# Altium schematic sheet ArbPwrBoost_P4.SchDoc: =ProjectTitle
size B; Engineer: Hab Collector; Organization: Altium Limited; Address1: 3621 Gin Way; Address2: Snellville, GA 30039; SheetNumber: 4; SheetTotal: 8
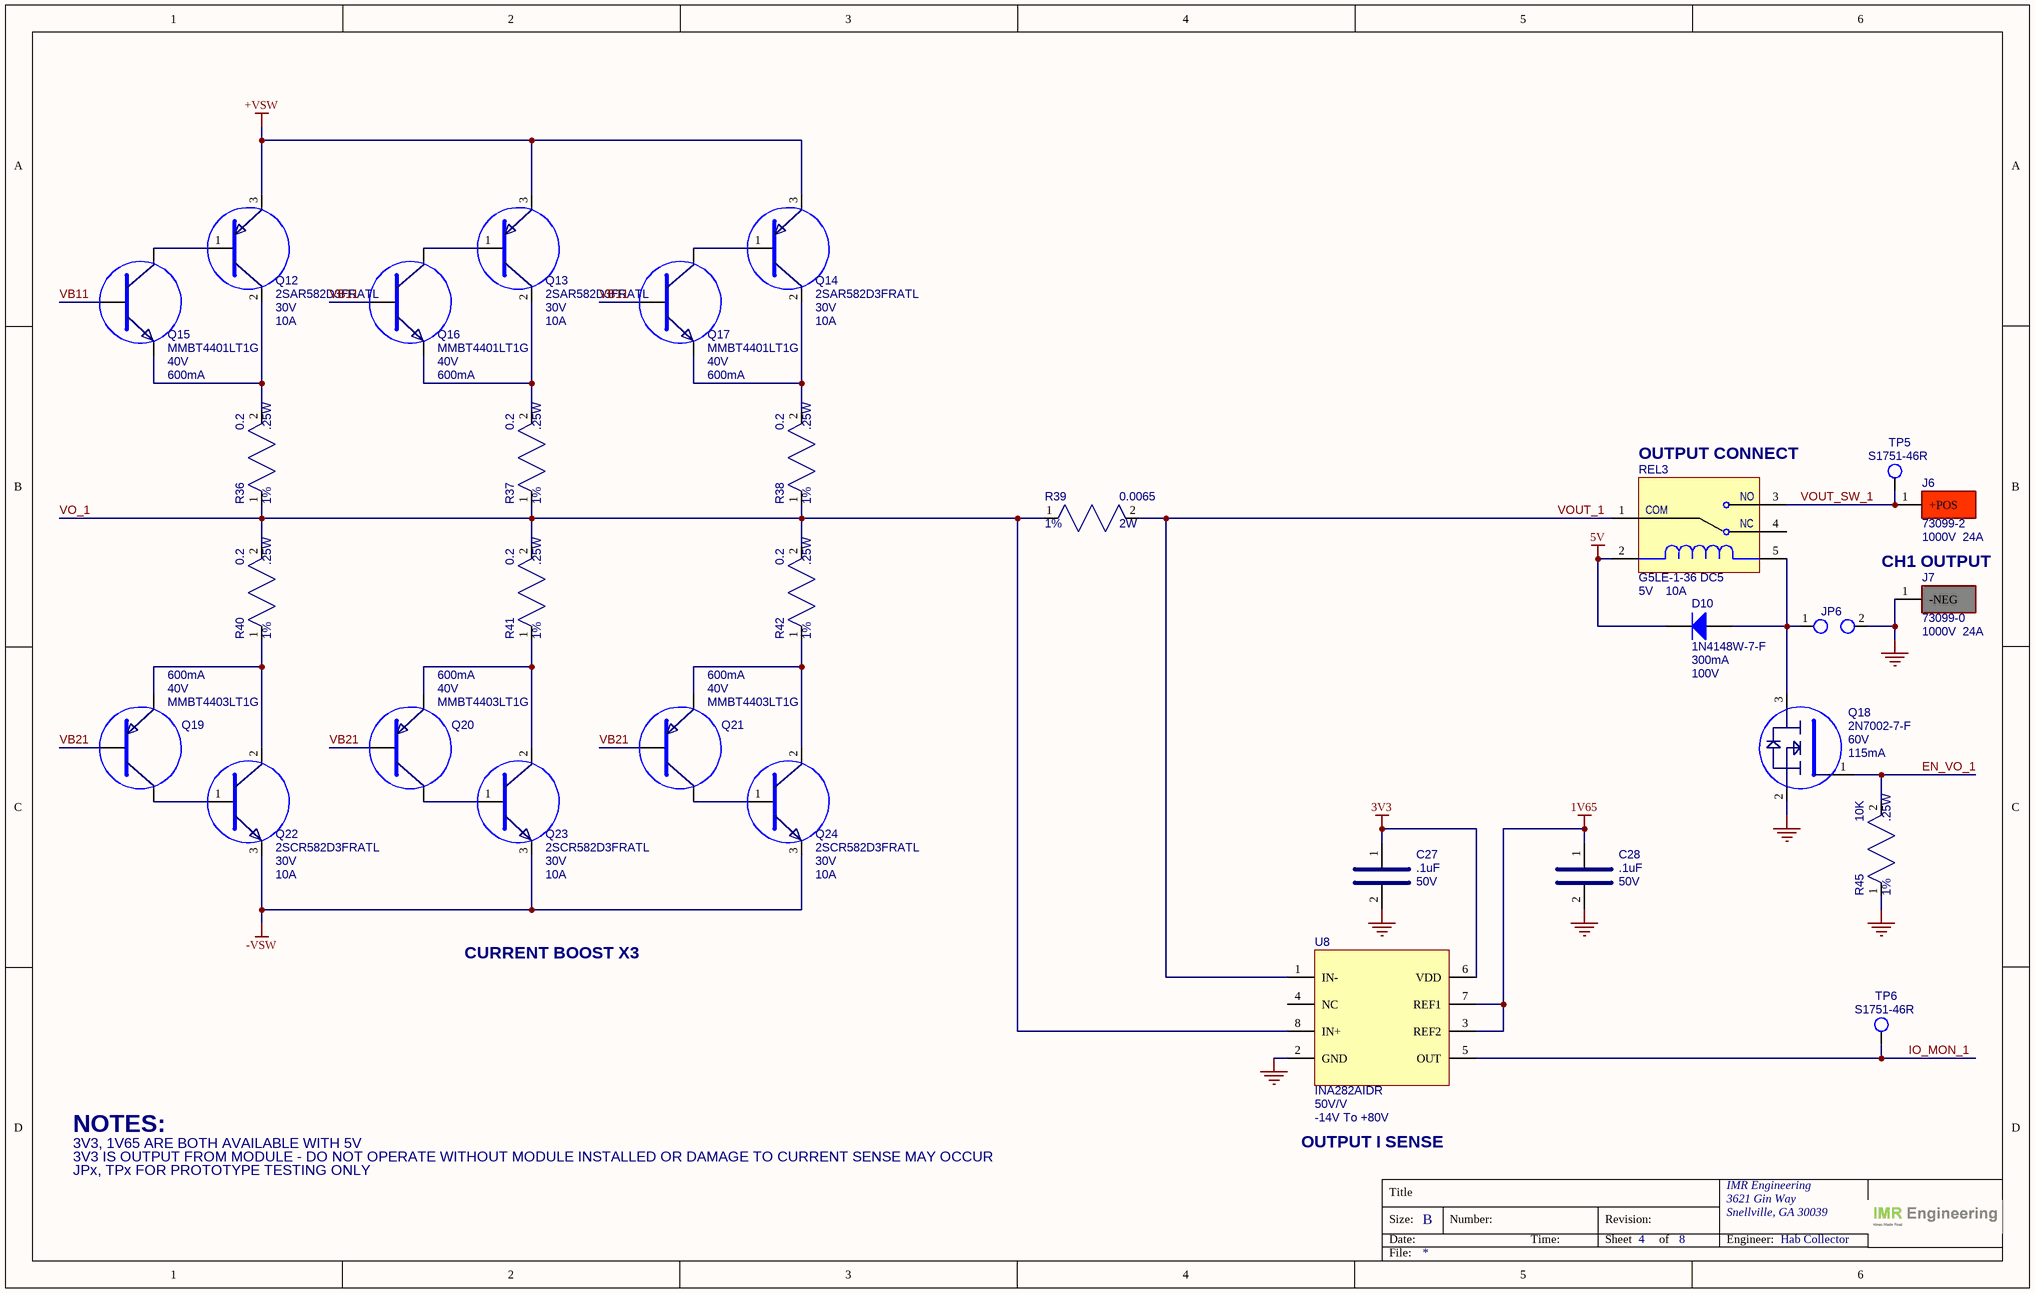
[diagram p0: ArbPwrBoost_P4.SchDoc]

## Parts
C27  value .1uF  Voltage: 50V  [CAP_0805]  (hidden comment: KGM21NR71H104KT)
C28  value .1uF  Voltage: 50V  [CAP_0805]  (hidden comment: KGM21NR71H104KT)
D10  value 100V  Current: 300mA  [SOD123]  (hidden comment: 1N4148W-7-F)
J6  value 1000V  Current: 24A  [Pomona_73099-2]  (hidden comment: 73099-2)
J7  value 1000V  Current: 24A  [Pomona_73099-0]  (hidden comment: 73099-0)
JP6  PREC002SFAN-RC  [HDR_1X2_100MILL]  (value not drawn)
Q12  value 30V  Current: 10A  [TO-252]  (hidden comment: 2SAR582D3FRATL)
Q13  value 30V  Current: 10A  [TO-252]  (hidden comment: 2SAR582D3FRATL)
Q14  value 30V  Current: 10A  [TO-252]  (hidden comment: 2SAR582D3FRATL)
Q15  value 40V  Current: 600mA  [SOT-23]  (hidden comment: MMBT4401LT1G)
Q16  value 40V  Current: 600mA  [SOT-23]  (hidden comment: MMBT4401LT1G)
Q17  value 40V  Current: 600mA  [SOT-23]  (hidden comment: MMBT4401LT1G)
Q18  value 60V  Current: 115mA  [SOT-23]  (hidden comment: 2N7002-7-F)
Q19  value 40V  Current: 600mA  [SOT-23]  (hidden comment: MMBT4403LT1G)
Q20  value 40V  Current: 600mA  [SOT-23]  (hidden comment: MMBT4403LT1G)
Q21  value 40V  Current: 600mA  [SOT-23]  (hidden comment: MMBT4403LT1G)
Q22  value 30V  Current: 10A  [TO-252]  (hidden comment: 2SCR582D3FRATL)
Q23  value 30V  Current: 10A  [TO-252]  (hidden comment: 2SCR582D3FRATL)
Q24  value 30V  Current: 10A  [TO-252]  (hidden comment: 2SCR582D3FRATL)
R36  value 0.2  Power: .25W  Tolerance: 1%  [RES_1206]  (hidden comment: RL1206FR-070R2L)
R37  value 0.2  Power: .25W  Tolerance: 1%  [RES_1206]  (hidden comment: RL1206FR-070R2L)
R38  value 0.2  Power: .25W  Tolerance: 1%  [RES_1206]  (hidden comment: RL1206FR-070R2L)
R39  value 0.0065  Tolerance: 1%  Power: 2W  [RES_2512]  (hidden comment: WSL25126L500FEA18)
R40  value 0.2  Power: .25W  Tolerance: 1%  [RES_1206]  (hidden comment: RL1206FR-070R2L)
R41  value 0.2  Power: .25W  Tolerance: 1%  [RES_1206]  (hidden comment: RL1206FR-070R2L)
R42  value 0.2  Power: .25W  Tolerance: 1%  [RES_1206]  (hidden comment: RL1206FR-070R2L)
R45  value 10K  Power: .25W  Tolerance: 1%  [RES_0805]  (hidden comment: RC0805FR-7W10KL)
REL3  value 5V  Current: 10A  [G5LE]  (hidden comment: G5LE-1-36 DC5)
TP5  S1751-46R  [HARWIN_S1751]
TP6  S1751-46R  [HARWIN_S1751]
U8  value 50V/V  Common Mode: -14V To +80V  [SOIC-8_54]  (hidden comment: INA282AIDR)

## Nets
1V65: C28.1 U8.3(REF2) U8.7(REF1)
3V3: C27.1 U8.6(VDD)
5V: D10.2(K) REL3.2
+VSW: Q12.3(E) Q13.3(E) Q14.3(E)
-VSW: Q22.3(E) Q23.3(E) Q24.3(E)
GND: C27.2 C28.2 J7.1(-NEG) JP6.2 Q18.2(E) R45.1 U8.2(GND)
EN_VO_1: Q18.1(B) R45.2
IO_MON_1: TP6.1 U8.5(OUT)
VB11: Q15.1(B) Q16.1(B) Q17.1(B)
VB21: Q19.1(B) Q20.1(B) Q21.1(B)
VO_1: R36.1 R37.1 R38.1 R39.1 R40.2 R41.2 R42.2 U8.8(IN+)
VOUT_1: R39.2 REL3.1(COM) U8.1(IN-)
VOUT_SW_1: J6.1(+POS) REL3.3(NO) TP5.1
NetD10_1: D10.1(A) JP6.1 Q18.3(C) REL3.5
NetQ12_1: Q12.1(B) Q15.3(C)
NetQ12_2: Q12.2(C) Q15.2(E) R36.2
NetQ13_1: Q13.1(B) Q16.3(C)
NetQ13_2: Q13.2(C) Q16.2(E) R37.2
NetQ14_1: Q14.1(B) Q17.3(C)
NetQ14_2: Q14.2(C) Q17.2(E) R38.2
NetQ19_2: Q19.2(E) Q22.2(C) R40.1
NetQ19_3: Q19.3(C) Q22.1(B)
NetQ20_2: Q20.2(E) Q23.2(C) R41.1
NetQ20_3: Q20.3(C) Q23.1(B)
NetQ21_2: Q21.2(E) Q24.2(C) R42.1
NetQ21_3: Q21.3(C) Q24.1(B)

Not connected (* = marked no-connect by the designer): REL3 4(NC); U8 4(NC)

## Notes on the sheet
- (near REL3) OUTPUT CONNECT
- (near J7) CH1 OUTPUT
- CURRENT BOOST X3
- NOTES:
- 3V3, 1V65 ARE BOTH AVAILABLE WITH 5V
- 3V3 IS OUTPUT FROM MODULE - DO NOT OPERATE WITHOUT MODULE INSTALLED OR DAMAGE TO CURRENT SENSE MAY OCCUR
- JPx, TPx FOR PROTOTYPE TESTING ONLY
- OUTPUT I SENSE
- Title
- Size:
- Date:
- B
- Number:
- Time:
- Revision:
- Sheet
- of
- IMR Engineering
- Engineer:
- File:

## Library data of the parts
C27 C28 = CAP_SMD_0.1UF_50V_0805: CAP CER 0.1UF 50V X7R 0805; MFG: KYOCERA AVX; Case/Package: 0805; MFG_PN: KGM21NR71H104KT; Supplier 1: DigiKey; Supplier Part Number 1: 478-KGM21NR71H104KTCT-ND; Unit Price: .1
D10 = DIODE_1N4148W-7-F: RELAY REED SPDT 250MA 5V; MFG: Diodes Inc; Case/Package: SOD-123; Supplier 1: DigiKey; Supplier Part Number 1: 1N4148W-FDICT-ND; Unit Price: .16; MFG_PN: 1N4148W-7-F
J6 = CONN_PANOMA_73099-2: CONN 4mm Banana Socket Right Angle PCB RED; MFG: Pomona; Case/Package: 73099-2; Supplier 1: DigiKey; Supplier Part Number 1: 501-73099-2-ND; Unit Price: 10.39; MFG_PN: 73099-2
J7 = CONN_PANOMA_73099-0: CONN 4mm Banana Socket Right Angle PCB BLK; MFG: Pomona; Case/Package: 73099-0; Supplier 1: DigiKey; Supplier Part Number 1: 501-73099-0-ND; Unit Price: 10.39; MFG_PN: 73099-0
JP6 = CONN_JUMPER_2P_100MIL_VERT: CONN HEADER VERT 2POS 2.54MM; MFG: Sullins Connector Solutions; Case/Package: 2P_2.54MM; MFG_PN: PREC002SFAN-RC; Supplier 1: Digi-Key; Supplier Part Number 1: S1212EC-02-ND; Value: *; Unit Price: .07
Q12-Q14 = BJT_PNP_2SAR582D3FRATL: TRANS PNP 30V 5.7A TO-252; MFG: Rohm Semiconductor; Case/Package: TO-252; Supplier 1: DigiKey; Supplier Part Number 1: 846-2SAR582D3FRATLCT-ND; Unit Price: 1.59; MFG_PN: 2SAR582D3FRATL
Q15-Q17 = BJT_NPN_MMBT4401LT1G: TRANS NPN 40V 0.6A SOT23-3; MFG: On Semiconductor; Case/Package: SOT-23; Supplier 1: DigiKey; Supplier Part Number 1: MMBT4401LT1GOSCT-ND; Unit Price: .13; MFG_PN: MMBT4401LT1G
Q18 = MOSFET_NCH_2N7002-7-F: MOSFET N-CH 60V 115MA SOT23-3; MFG: Diodes Inc; Case/Package: SOT-23; Supplier 1: DigiKey; Supplier Part Number 1: 2N7002-FDICT-ND; Unit Price: .20; MFG_PN: 2N7002-7-F
Q19-Q21 = BJT_PNP_MMBT4403LT1G: TRANS PNP 40V 0.6A SOT23-3; MFG: On Semiconductor; Case/Package: SOT-23; Supplier 1: DigiKey; Supplier Part Number 1: MMBT4403LT1GOSCT-ND; Unit Price: .13; MFG_PN: MMBT4403LT1G
Q22-Q24 = BJT_NPN_2SCR582D3FRATL: TRANS NPN 30V 10A TO-252; MFG: Rohm Semiconductor; Case/Package: TO-252; Supplier 1: DigiKey; Supplier Part Number 1: 846-2SCR582D3FRATLCT-ND; Unit Price: 1.76; MFG_PN: 2SCR582D3FRATL
R36-R38 R40-R42 = RES_SMD_0.2_1206_1/4W_1%: RES SMD 0.2 OHM 1% 1/4W 1206; MFG: Yageo; Case/Package: 1206; MFG_PN: RL1206FR-070R2L; Supplier 1: DigiKey; Supplier Part Number 1: 311-0.2LWCT-ND; Unit Price: .27
R39 = RES_SMD_0.0065_2512_2W_1%: RES SMD 0.0065 OHM 1% 2W 2512; MFG: Vishay Dale; Case/Package: 2512; MFG_PN: WSL25126L500FEA18; Supplier 1: DigiKey; Supplier Part Number 1: 541-WSL25126L500FEA18CT-ND; Unit Price: 1.76
R45 = RES_SMD_10K_0805_1/4W_1%: RES SMD 10K OHM 1% 1/4W 0805; MFG: Yageo; Case/Package: 0805; MFG_PN: RC0805FR-7W10KL; Supplier 1: DigiKey; Supplier Part Number 1: 13-RC0805FR-7W10KLCT-ND; Unit Price: .10
REL3 = RELAY_G5LE-1-36 DC5: RELAY GEN PURPOSE SPDT 10A 5V; MFG: Omron; Case/Package: G5LE; Supplier 1: DigiKey; Supplier Part Number 1: G5LE-1-36DC5-ND; Unit Price: 1.24; Supplier: DigiKey; Manufacturer: Omron; MFG_PN: G5LE-1-36 DC5
TP5 TP6 = CONN_TEST_POINT_S1751-46R: PCB TEST POINT CONNECT; MFG: Harwin Inc; Case/Package: S1751; MFG_PN: S1751-46R; Supplier 1: Digi-Key; Supplier Part Number 1: 952-1478-1-ND; Value: *; Unit Price: .28
U8 = IC_INA282AIDR: IC CURRENT SENSE 0.4% 50V/V SOIC-8; MFG: Texas Instruments; Case/Package: SOIC-8; Supplier 1: DigiKey; Supplier Part Number 1: 296-27820-1-ND; Unit Price: 4.13; MFG_PN: INA282AIDR